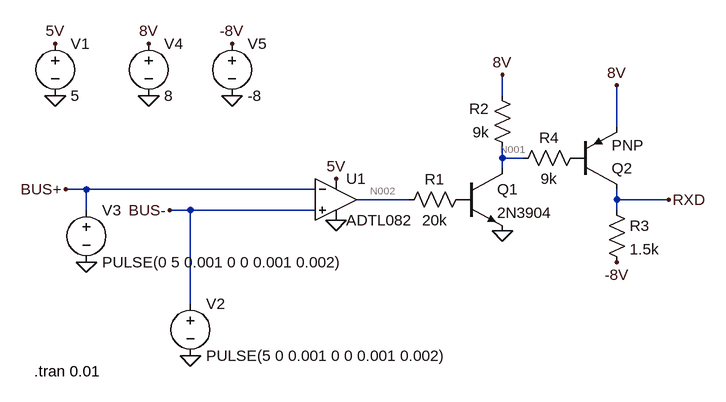
[diagram p0: schematic rx-sim.asc]
rx-sim.asc, the LTspice schematic file:
Version 4
SHEET 1 880 680
WIRE 448 16 448 -16
WIRE 624 64 624 0
WIRE 448 112 448 96
WIRE 480 112 448 112
WIRE 448 128 448 112
WIRE -192 160 -224 160
WIRE 160 160 -192 160
WIRE 304 176 224 176
WIRE 624 176 624 160
WIRE 704 176 624 176
WIRE -192 192 -192 160
WIRE -32 192 -64 192
WIRE 160 192 -32 192
WIRE 624 192 624 176
WIRE -32 336 -32 192
FLAG 192 208 0
FLAG -240 16 0
FLAG -240 -64 5V
FLAG 192 144 5V
FLAG -192 272 0
FLAG -32 416 0
FLAG -64 192 BUS-
FLAG -224 160 BUS+
FLAG 448 224 0
FLAG 704 176 RXD
FLAG -96 16 0
FLAG -96 -64 8V
FLAG 624 0 8V
FLAG 448 -16 8V
FLAG 32 16 0
FLAG 32 -64 -8V
FLAG 624 272 -8V
SYMBOL Opamps\\ADTL082 192 112 R0
SYMATTR InstName U1
SYMBOL voltage -240 -80 R0
WINDOW 123 0 0 Left 0
WINDOW 39 0 0 Left 0
SYMATTR InstName V1
SYMATTR Value 5
SYMBOL voltage -32 320 R0
WINDOW 123 0 0 Left 0
WINDOW 39 0 0 Left 0
SYMATTR InstName V2
SYMATTR Value PULSE(5 0 0.001 0 0 0.001 0.002)
SYMBOL voltage -192 176 R0
WINDOW 123 0 0 Left 0
WINDOW 39 0 0 Left 0
SYMATTR InstName V3
SYMATTR Value PULSE(0 5 0.001 0 0 0.001 0.002)
SYMBOL npn 384 128 R0
SYMATTR InstName Q1
SYMATTR Value 2N3904
SYMBOL res 400 160 R90
WINDOW 0 0 56 VBottom 2
WINDOW 3 32 56 VTop 2
SYMATTR InstName R1
SYMATTR Value 20k
SYMBOL res 464 112 R180
WINDOW 0 36 76 Left 2
WINDOW 3 36 40 Left 2
SYMATTR InstName R2
SYMATTR Value 9k
SYMBOL pnp 560 160 M180
SYMATTR InstName Q2
SYMBOL res 608 176 R0
SYMATTR InstName R3
SYMATTR Value 1.5k
SYMBOL res 464 128 R270
WINDOW 0 32 56 VTop 2
WINDOW 3 0 56 VBottom 2
SYMATTR InstName R4
SYMATTR Value 9k
SYMBOL voltage -96 -80 R0
WINDOW 123 0 0 Left 0
WINDOW 39 0 0 Left 0
SYMATTR InstName V4
SYMATTR Value 8
SYMBOL voltage 32 -80 R0
WINDOW 123 0 0 Left 0
WINDOW 39 0 0 Left 0
SYMATTR InstName V5
SYMATTR Value -8
TEXT -272 440 Left 2 !.tran 0.01

The netlist it stands for:
* rx-sim.asc
XU1 BUS- BUS+ 5V 0 N002 ADTL082  ; pins In+ In- V+ V- OUT
V1 5V 0 5
V2 BUS- 0 PULSE(5 0 0.001 0 0 0.001 0.002)
V3 BUS+ 0 PULSE(0 5 0.001 0 0 0.001 0.002)
Q1 N001 P001 0 0 2N3904
R1 P001 N002 20k
R2 N001 8V 9k
Q2 RXD P002 8V 0 PNP
R3 RXD -8V 1.5k
R4 N001 P002 9k
V4 8V 0 8
V5 -8V 0 -8
.model NPN NPN
.model PNP PNP
.lib standard.bjt
.tran 0.01
.lib ADI.lib
.backanno
.end

* Results of the author's LTspice run, read from the files saved beside the schematic
* Operating Point, zero values left out:
*   V(bus-) = 5 V
*   V(5v) = 5 V
*   V(n002) = 4.375 V
*   V(n001) = 33.96 mV
*   V(p001) = 683.5 mV
*   V(8v) = 8 V
*   V(rxd) = 7.926 V
*   V(p002) = 7.162 V
*   V(-8v) = -8 V
*   Ic(Q2) = -10.62 mA
*   Ib(Q2) = -792 µA
*   Ie(Q2) = 11.41 mA
*   Ic(Q1) = 1.677 mA
*   Ib(Q1) = 184.6 µA
*   Ie(Q1) = -1.862 mA
*   I(R4) = -792 µA
*   I(R3) = 10.62 mA
*   I(R2) = -885.1 µA
*   I(R1) = -184.6 µA
*   I(V5) = 10.62 mA
*   I(V4) = -12.29 mA
*   I(V3) = 20 pA
*   I(V2) = -22 pA
*   I(V1) = -1.71 mA
*   Ix(u1:1) = 22 pA
*   Ix(u1:2) = -20 pA
*   Ix(u1:3) = 1.71 mA
*   Ix(u1:4) = -1.586 mA
*   Ix(u1:5) = -184.6 µA
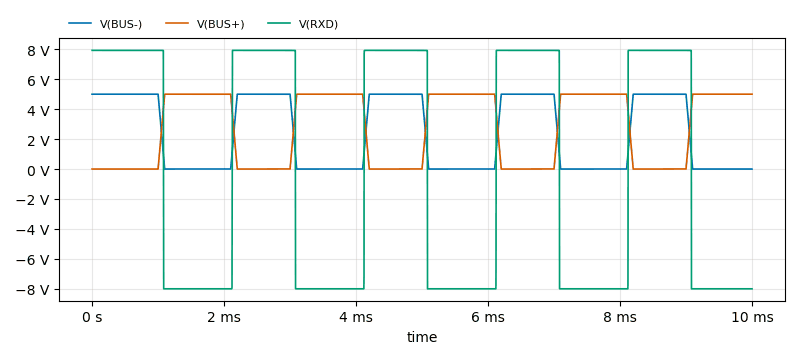
[diagram p1: Transient Analysis of rx-sim.asc, plotted from the saved traces]
* Transient Analysis, 1 run:
*   V(BUS-): min 0 V, max 5 V, average 2.325 V, rms 3.354 V, last 0 V
*   V(BUS+): min 0 V, max 5 V, average 2.675 V, rms 3.606 V, last 5 V
*   V(RXD): min -8 V, max 7.926 V, average -170.5 mV, rms 7.957 V, last -8 V